# Altium schematic sheet stepper_control.SchDoc
size A; SheetNumber: 2; SheetTotal: 3
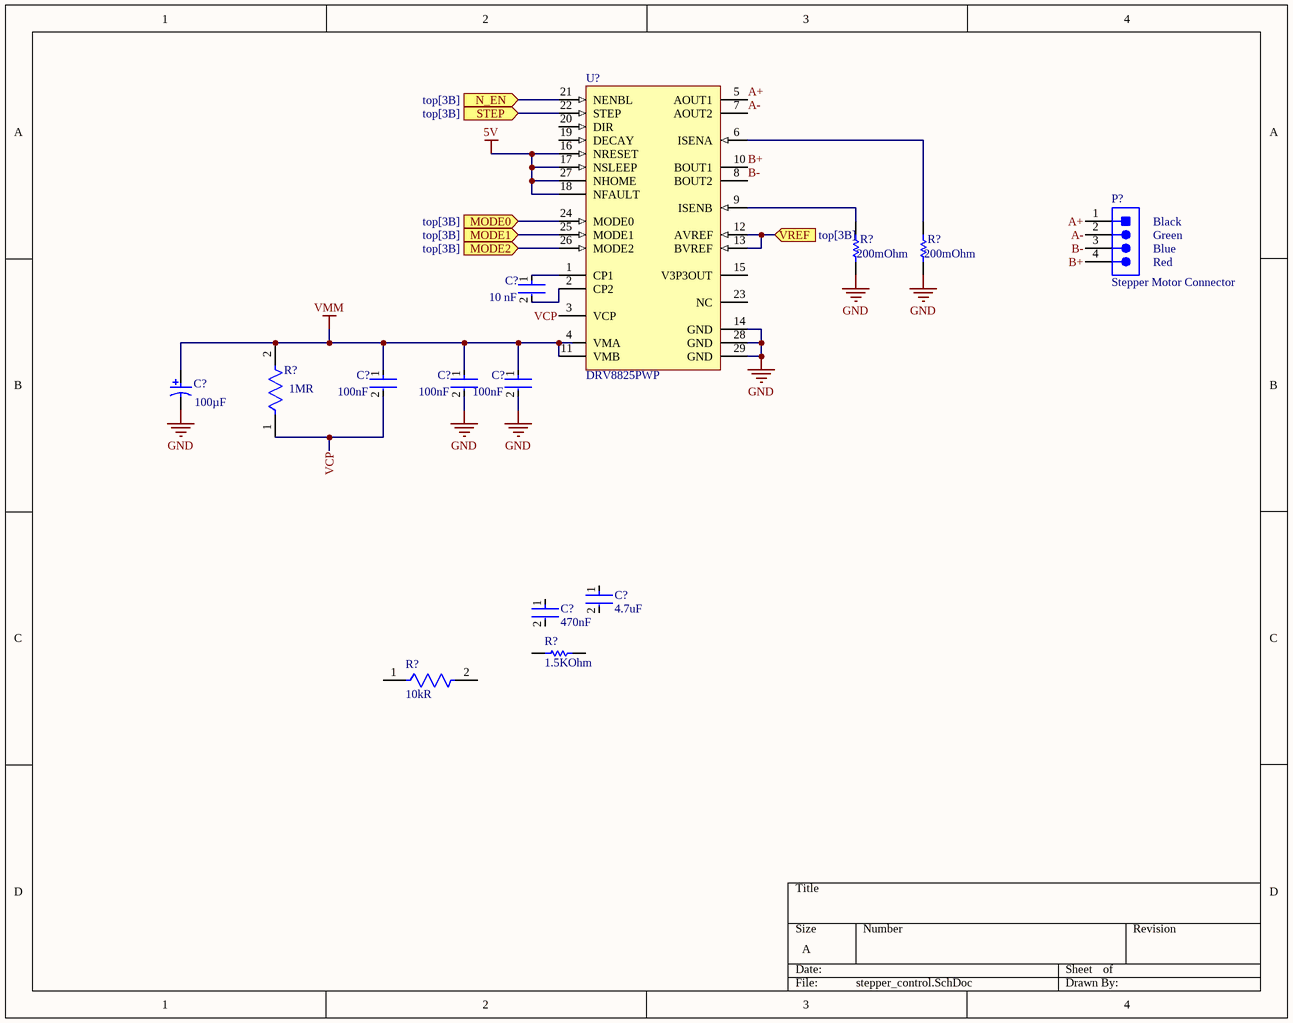
[diagram p0: stepper_control.SchDoc]

## Parts
(Parts that share a designator on the sheet are numbered #1, #2 ... from top to bottom, then left to right.)
C?#1  value 10 nF  [FP-CC0603-DA-MFG]  (hidden comment: CC0603KRX7R9BB103)
C?#2  Capacitance: 100µF  [PNSC-FK-V-D8_V]  (hidden comment: EEEFK1E101XP)
C?#3  value 100nF  [FP-C0603-CJ-MFG]  (hidden comment: C0603X104K5RACTU)
C?#4  value 100nF  [FP-C0603-CJ-MFG]  (hidden comment: C0603X104K5RACTU)
C?#5  value 100nF  [FP-C0603-CJ-MFG]  (hidden comment: C0603X104K5RACTU)
C?#6  Capacitance: 4.7uF  [FP-GRM188-0_2-IPC_C]  (hidden comment: GRM188R6YA475KE15D)
C?#7  Capacitance: 470nF  [FP-GRM188-0_1-e0_2_0_5-MFG]  (hidden comment: GRM188R71E474KA12D)
P?  Stepper Motor Connector  [JST-B4B-PH-K-S_V]
R?#1  Resistance: 200mOhm  [RESC1609X60X30LL10T20]  (hidden comment: RCWE0603R200FKEA)
R?#2  Resistance: 200mOhm  [RESC1609X60X30LL10T20]  (hidden comment: RCWE0603R200FKEA)
R?#3  Resistance: 1MR  [FP-CRCW0603-HPe3-IPC_B]  (hidden comment: CRCW06031M00FKEAHP)
R?#4  Resistance: 1.5KOhm  [RESC1608X55X25ML10T15]  (hidden comment: RC0603FR-071K5L)
R?#5  Resistance: 10kR  [FP-RC0603-0_55-IPC_C]  (hidden comment: RC0603FR-0710KL)
U?  DRV8825PWP  [PWP0028C_L]

## Ports
MODE0 (in, see top[3B]), MODE1 (in, see top[3B]), MODE2 (in, see top[3B]), N_EN (in, see top[3B]), STEP (in, see top[3B]), VREF (in, see top[3B])

## Nets
5V: U?.16(NRESET) U?.17(NSLEEP) U?.18(NFAULT) U?.27(NHOME)
GND: C?#2.2 C?#4.2 C?#5.2 R?#1.2 R?#2.2 U?.14(GND) U?.28(GND) U?.29(GND)
VMM: C?#2.1 C?#3.1 C?#4.1 C?#5.1 R?#3.2 U?.4(VMA) U?.11(VMB)
A+: P?.1 U?.5(AOUT1)
A-: P?.2 U?.7(AOUT2)
B+: P?.4 U?.10(BOUT1)
B-: P?.3 U?.8(BOUT2)
MODE0: U?.24(MODE0) ; port MODE0
MODE1: U?.25(MODE1) ; port MODE1
MODE2: U?.26(MODE2) ; port MODE2
N_EN: U?.21(NENBL) ; port N_EN
STEP: U?.22(STEP) ; port STEP
VCP: C?#3.2 R?#3.1 U?.3(VCP)
VREF: U?.12(AVREF) U?.13(BVREF) ; port VREF
NetC?#1_1: C?#1.1 U?.1(CP1)
NetC?#1_2: C?#1.2 U?.2(CP2)
NetR?#1_1: R?#1.1 U?.9(ISENB)
NetR?#2_1: R?#2.1 U?.6(ISENA)

Not connected (* = marked no-connect by the designer): C?#6 1 2; C?#7 1 2; R?#4 1 2; R?#5 1 2; U? 15(V3P3OUT) 19(DECAY) 20(DIR) 23(NC)

## Notes on the sheet
- (near P?) Black
- (near P?) Green
- (near P?) Blue
- (near P?) Red

## Library data of the parts
C?#1 = CMP-2100-03600-2: CAP CER 10000PF 50V X7R 0603; Manufacturer: YAGEO; Tolerance: 0.1; Material: Ceramic; Temperature Coefficient: 15%; Description: CC0603 10 nF X7R 10.00% 50 V; Mouser Description: Multilayer Ceramic Capacitor, CC Series, 0.01 - F, - 10%, X7R, 50 V, 0603 [1608 Metric]; Digikey Description: CAP CER 10000PF 50V X7R 0603; Height: 0.9mm; Category: Cap; Temperature Characteristic: X7R; Footprint Url: http://www.yageo.com/exep/pages/download/literatures/UPY-C_GEN_24.pdf; Lead Free: Yes; Voltage Rating: 50 V; Manufacturer Part Number: CC0603KRX7R9BB103; Temperature: -55°C to +125°C; Device Class L3: Ceramic Capacitors; ComponentLink2Description: Datasheet; Voltage: 50 V; Package: CC0603-DA; Octopart: https://octopart.com/cc0603krx7r9bb103-yageo-192938; Automotive: No; Temperature Range High: +125°C; Temperature Range Low: -55°C; RoHS: TRUE; Device Class L1: Passive Components; ComponentLink2URL: http://www.yageo.com/documents/recent/UPY-GPHC_X7R_6.3V-to-50V_18.pdf; Device Class L2: Capacitors; Capacitance: 10 nF
C?#2 = CMP-2000-06206-1: Aluminum Electrolytic Capacitor, 100 uF, +/- 20%, 25 V, 2-Pin SMD (Size Code D8), -55 to 105 degC, RoHS, Tape and Reel; Manufacturer: Panasonic; Type: Can; Lifetime@Temperature: 2000Hrs@105°C; Rated Voltage: 25V; Ripple Current: 280mA; Impedance: 0.34O; Case Size/Dimension: Ø6.3x7.7mm; Operating Temp-Max: 105°C; Series: FK; Package URL: http://industrial.panasonic.com/cdbs/www-data/pdf/RDE0000/DME0000COL48.pdf; Mounting Technology: SurfaceMount; Package Description: 2-Pin Electrolytic Aluminum Capacitor, Body 6.6 x 6.6 mm; Datasheet Version: 03/2016; Datasheet URL: http://industrial.panasonic.com/cdbs/www-data/pdf/RDE0000/ABA0000C1181.pdf; Manufacturer URL: http://www.panasonic.com/; Package Reference: FK-V-D8; Operating Temp Range: -55to+105°C
C?#3-C?#5 = CMP-2006-03300-2: CAP CER 0.1UF 50V X7R 0603; Manufacturer: Kemet; Description: Ceramic Chip Capacitor 0.1µF ±10% 50V; Material: Ceramic; Tolerance: 10%; Temperature Coefficient: 15%; Temperature Range High: +125°C; Temperature Range Low: -55°C; Manufacturer Part Number: C0603X104K5RACTU; Voltage: 50V; ComponentLink2Description: Datasheet; RoHS: TRUE; ComponentLink2URL: https://content.kemet.com/datasheets/KEM_C1013_X7R_FT-CAP_SMD.pdf; Capacitance: 100nF; Device Class L3: Ceramic Capacitors; Device Class L2: Capacitors; Package: C0603-CJ; Height: 0.95mm; Device Class L1: Passive Components; Temperature Characteristic: X7R; Lead Free: Yes; Digikey Description: CAP CER 0.1UF 50V X7R 0603; Automotive: No; Mouser Description: Capacitor; Ceramic; Cap 0.1uF; Tol+10%; SMT; Flexible Termination; Vol-Rtg 50V; TR; Temperature: -55°C to +125°C; Octopart: https://octopart.com/c0603x104k5ractu-kemet-9145062; Category: Cap; Voltage Rating: 50V; Ipc Land Pattern Name: CAPC16080X80
C?#6 = CMP-2006-02545-2: Chip Multilayer Ceramic Capacitors for General Purpose, 0603, 4.7uF, X5R, 15%, 10%, 35V; Lead Free: Lead Free; Max Operating Temperature: 85°C; Case Code (Imperial): 0603; Width: 0.8mm; Thickness: 0.031inch; Case Code (Metric): 1608; Min Operating Temperature: -55°C; Voltage Rating (DC): 35V; Dielectric: X5R; Voltage: 35V; Packaging: Tape and Reel; Resistor Type: Ceramic; Weight: 0.000222oz; Mount: Surface Mount; Material: Ceramic; Depth: 0.8mm; Tolerance: 10%; REACH SVHC: No SVHC; Case/Package: 0603; Voltage Rating: 35V; Package Quantity: 4000; Height: 0.8mm; Length: 1.6mm; Termination: SMD/SMT
C?#7 = CMP-06035-003857-1: Chip Multilayer Ceramic Capacitors for General Purpose, 0603, 0.47uF, X7R, 15%, 10%, 25V; Voltage: 50V; Case Code (Imperial): 0603; Mount: Surface Mount; Material: Ceramic; Case/Package: 0603; Thickness: 0.035inch; Tolerance: 10%; Length: 1.6mm; Lead Free: Lead Free; Voltage Rating: 25V; Width: 0.031inch; Voltage Rating (DC): 25V; Dielectric: X7R; Case Code (Metric): 1608; Number of Pins: 2; Termination: SMD/SMT; REACH SVHC: No SVHC; Min Operating Temperature: -55°C; Max Operating Temperature: 125°C; Depth: 0.8mm; Height: 0.8mm; Package Quantity: 4000; Packaging: Tape and Reel
P? = CMP-2000-05165-1: Male Header, Pitch 2 mm, 1 x 4 Position, Height 6 mm, Tail Length 3.4 mm, -25 to 85 degC, RoHS, Bulk; Manufacturer: JST; No of Positions: 4; Style/Orientation: StraightHeader/Plug; Pitch: 2mm; Datasheet URL: http://datasheet.octopart.com/B4B-PH-K-S%28LF%29%28SN%29-JST-datasheet-10558886.pdf; Type: ShroudedHeader; Manufacturer URL: http://www.jst.com/home2.html; Termination: Crimp; Datasheet Version: Apr-09
R?#1 R?#2 = CMP-2000-03665-1: Manufacturer: Vishay Dale; Part Number: RCWE0603R200FKEA
R?#3 = CMP-02407-005501-1: RES Thick Film, 1MΩ, 1%, 0.33W, 100ppm/°C, 0603; Max Power Dissipation: 250mW; Voltage Rating: 75V; Case Code (Imperial): 0603; Tolerance: 1%; Number of Terminations: 2; Width: 0.033inch; Composition: Thick Film; Contact Plating: Tin; Temperature Coefficient: 100ppm/°C; Package Quantity: 10; Length: 1.6mm; Min Operating Temperature: -55°C; Height: 0.45mm; Case Code (Metric): 1608; Lead Free: Lead Free; Termination: SMD/SMT; Packaging: Tape and Reel; Features: Automotive AEC-Q200; Max Operating Temperature: 155°C; Radiation Hardening: No; Case/Package: 0603; Depth: 0.85mm; Power Rating: 250mW; Weight: 7.1E-05oz
R?#4 = CMP-2100-03665-1: Chip Resistor, 1.5 KOhm, +/- 1%, 0.1 W, -55 to 155 degC, 0603 (1608 Metric), RoHS, Tape and Reel; Manufacturer: Yageo; Power Rating: 100mW; Voltage Rating: 50V; Temperature Coefficient: 100ppm/degreesC; Military Standard: Not; Datasheet URL: http://www.yageo.com/NewPortal/yageodocoutput?fileName=/pdf/R-Chip/PYu-RC_Group_51_RoHS_L_5.pdf; Package Description: 2-Pin Surface Mount Device, Body 1.6 x 0.8 mm; Composition: ThickFilm; Case Code (Metric): 1608; Case/Package: 0603; Number of Terminations: 2; Depth: 0.8mm; Height: 0.022inch; Manufacturer URL: http://www.yageo.com/; Lead Free: LeadFree; Min Operating Temperature: -55degC; Max Operating Temperature: 155degC; Datasheet Version: Rev. 5, 10/2016; RoHSCompliant: true; Max Power Dissipation: 100mW; Packaging: TapeandReel; Voltage Rating (DC): 50V; Length: 0.063inch; Tolerance: 1%; Width: 0.031inch; Number of Pins: 2; Termination: SMD/SMT; Package Reference: 0603; Package Quantity: 1; Case Code (Imperial): 0603; REACH SVHC: NoSVHC
R?#5 = CMP-2100-03664-2: RES 10K OHM 1% 1/10W 0603; Voltage Rating: 75V; Voltage Rating (DC): 50V; Power Rating: 100mW; Temperature Coefficient: 100ppm/°C; Depth: 0.8mm; Termination: SMD/SMT; Resistor Type: Thick Film; Series: RC; Construction: Rectangular; Features: Moisture Resistant; Packaging: Tape and Reel; Min Operating Temperature: -55°C; Number of Terminations: 2; Lead Pitch: 0.3mm; RoHS Compliant: Yes; Case/Package: 0603; Resistance Tolerance: 1%; Military Standard: Not; Weight: 7.1E-05oz; Number of Pins: 2; Tolerance: 1%; Length: 1.6mm; Case Code (Imperial): 0603; Lead Free: Lead Free; Width: 0.8mm; Max Power Dissipation: 100mW; Height: 0.45mm; Max Operating Temperature: 155°C; Case Code (Metric): 1608; Size Code: 0603
U? = CMP-1685-00019-1: Stepper Motor Controller IC, 8.2 to 45 V, -40 to 85 degC, 28-Pin HTSSOP (PWP), Green (RoHS & no Sb/Br), Tube; Voltage Rating: 100 V; Tolerance: 20%; Capacitance: 47 uF; Case\Package: Radial; ComponentLink2URL: http://www.ti.com/general/docs/lit/getliterature.tsp?genericPartNumber=DRV8825&fileType=pdf; Voltage Rating (DC): 100 V; Lead Pitch: 3.5 mm; Diameter: 8 mm; DatasheetVersion: SLVSA73F, 07/2014; ComponentLink2Description: Datasheet; Package Quantity: 200; PackageDescription: 28-Pin Small Outline Package Integrated Circuit, Body 9.7 x 4.4 mm, Pitch 0.65 mm; Packaging: Bulk; Pins: 2; Min Operating Temperature: -40 degC; Width: 8 mm; ComponentLink1Description: Manufacturer URL; Length: 11.5 mm; Max Operating Temperature: 85 degC; Height: 11.5 mm; REACH SVHC: No SVHC; Mount: Through Hole; PackageReference: PWP0028C; RoHSCompliant: true; Radiation Hardening: No; ComponentLink1URL: http://www.ti.com/